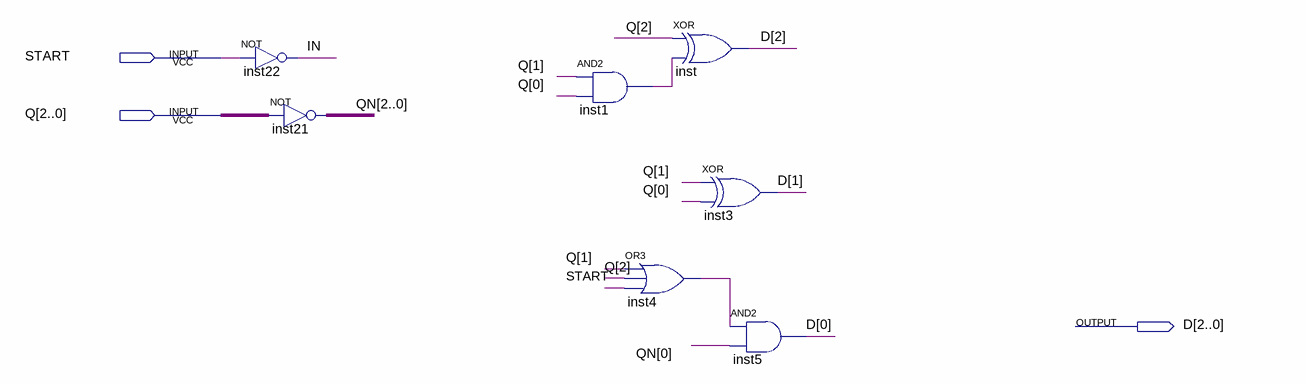
[diagram p0: schematic sheet]
// Quartus schematic NEXTSTATE.bdf as structural Verilog: 7 symbols, 3 pins
module NEXTSTATE (
  input  START,
  input  [2:0] Q,
  output [2:0] D
);

  wire IN, inst1_out, inst4_out;
  wire [2:0] QN;

  not inst22 (IN, START);
  assign QN = ~Q;  // NOT inst21, 3 bits wide
  and inst1 (inst1_out, Q[1], Q[0]);
  xor inst (D[2], Q[2], inst1_out);
  or inst4 (inst4_out, Q[1], Q[2], START);
  xor inst3 (D[1], Q[1], Q[0]);
  and inst5 (D[0], inst4_out, QN[0]);
endmodule
